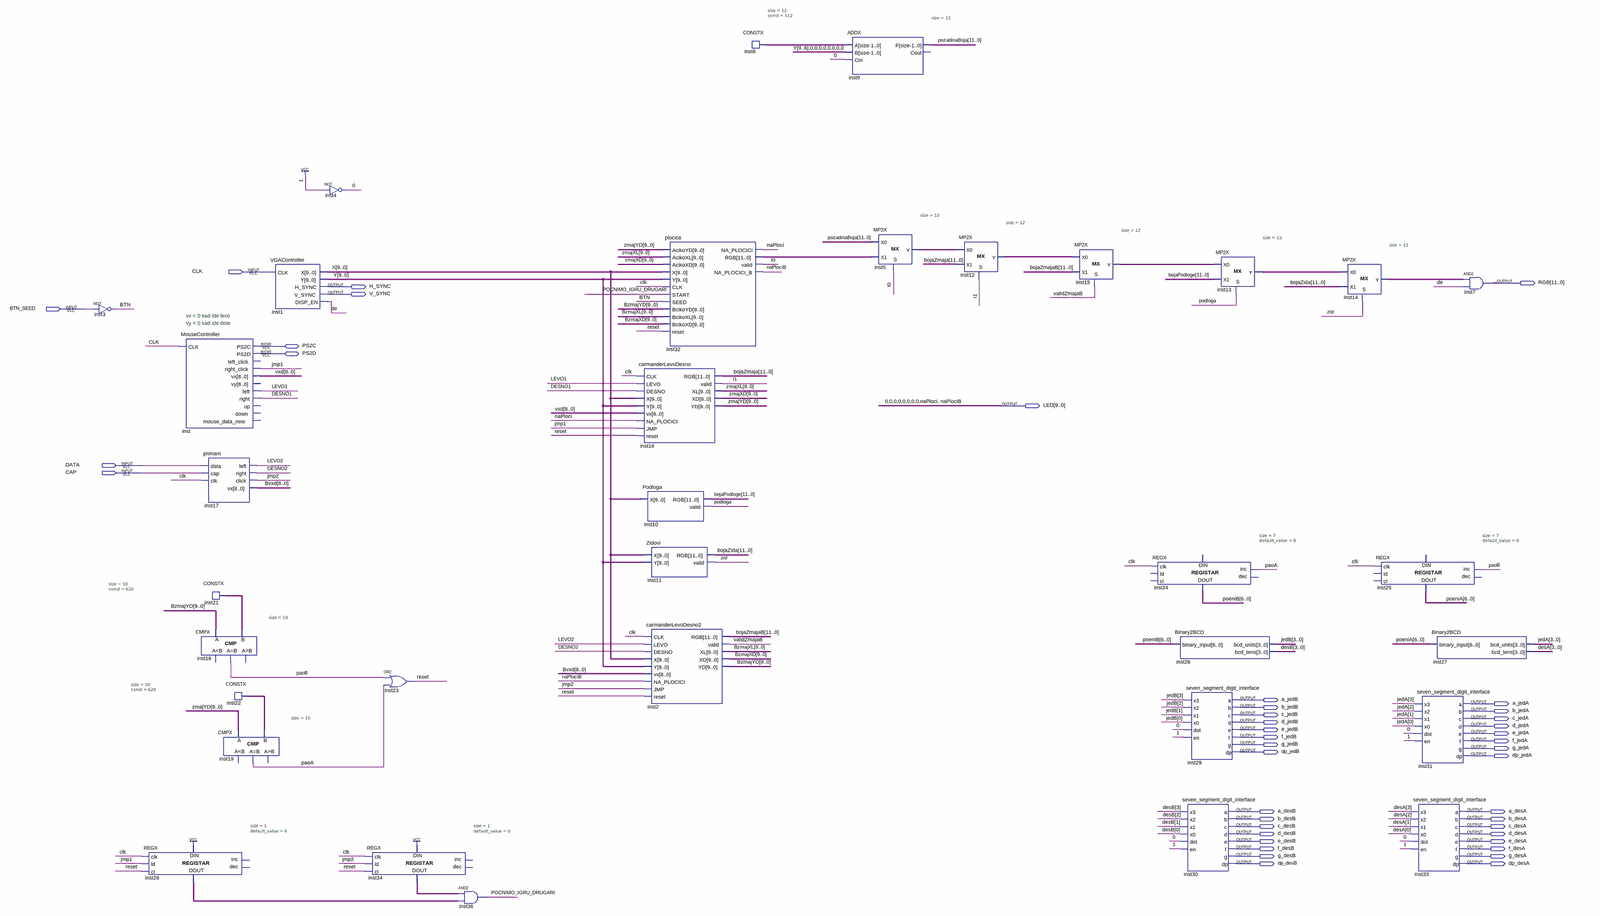
[diagram p0: schematic sheet, whole]
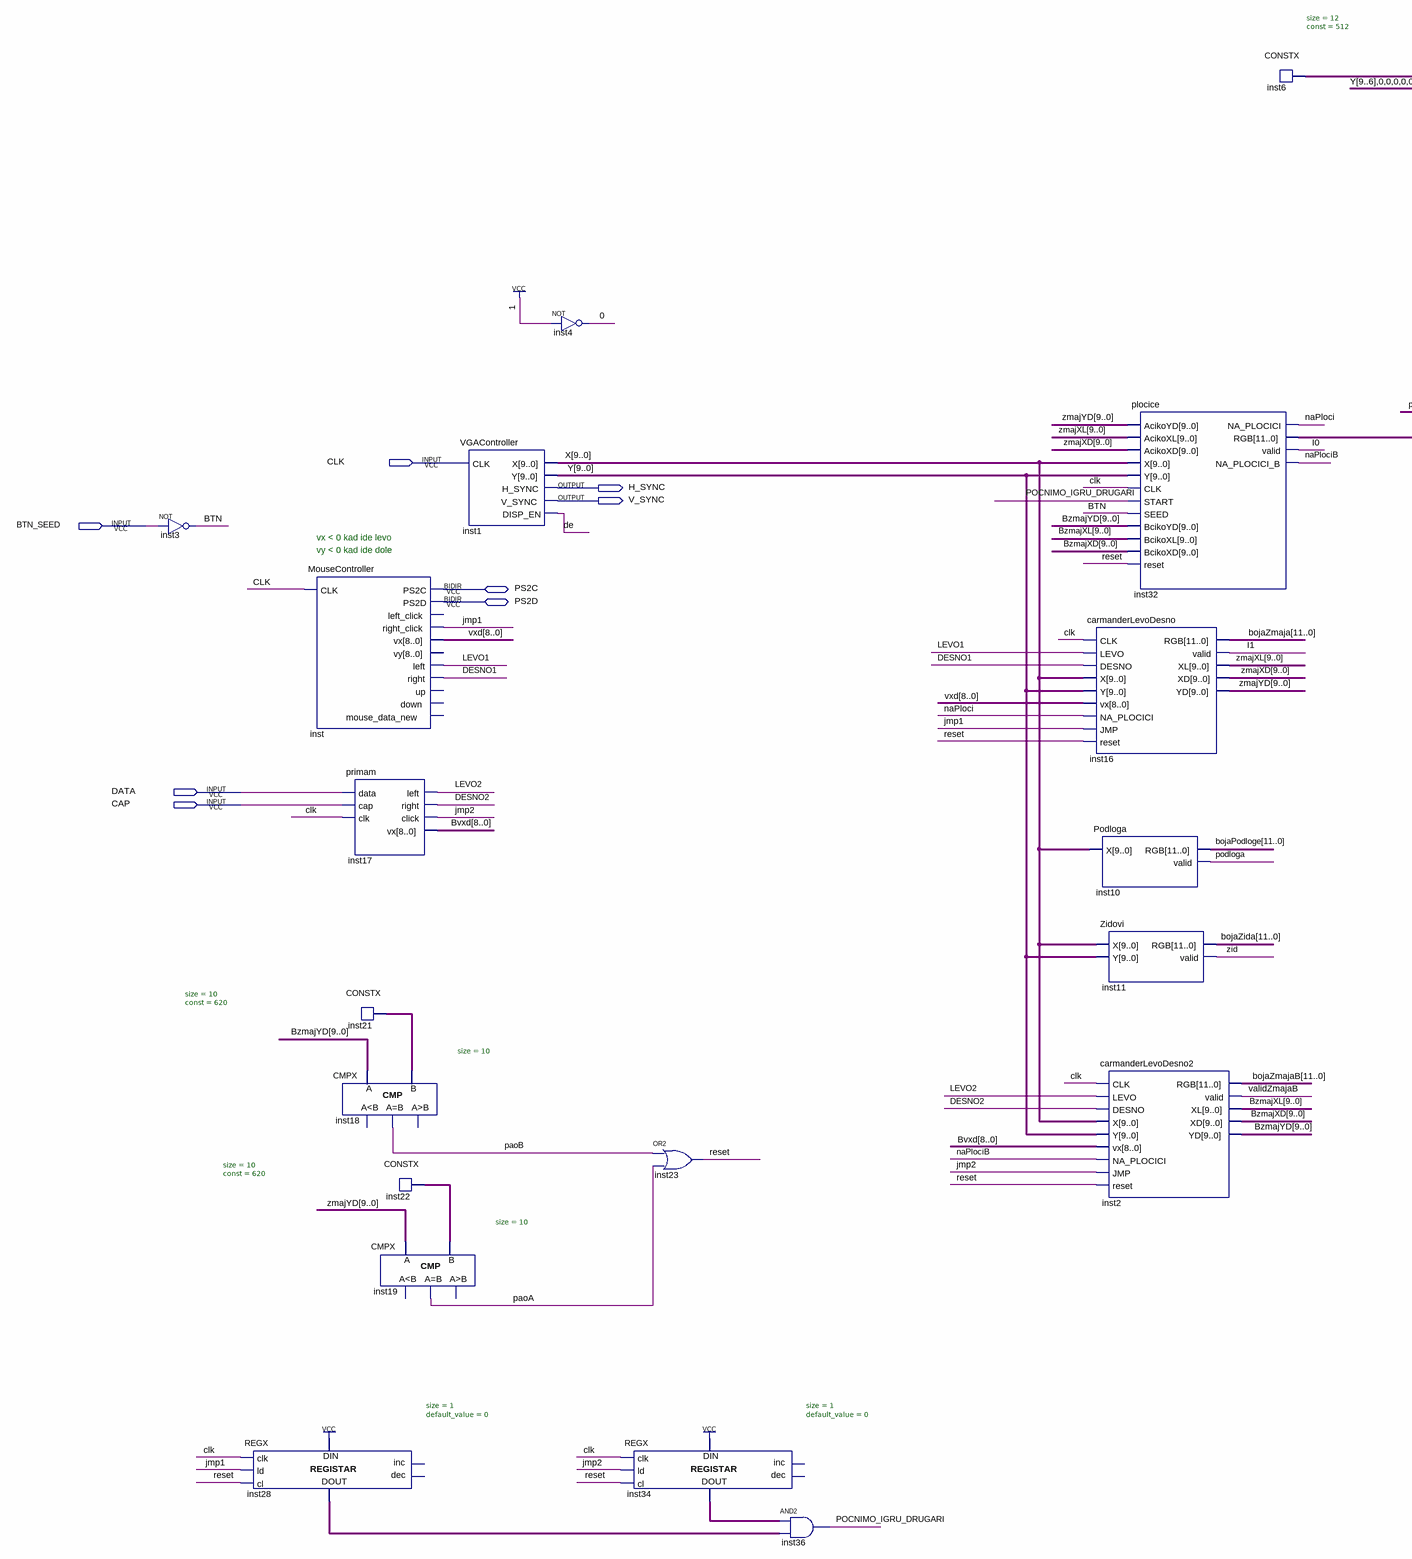
[diagram p1: schematic sheet, left part]
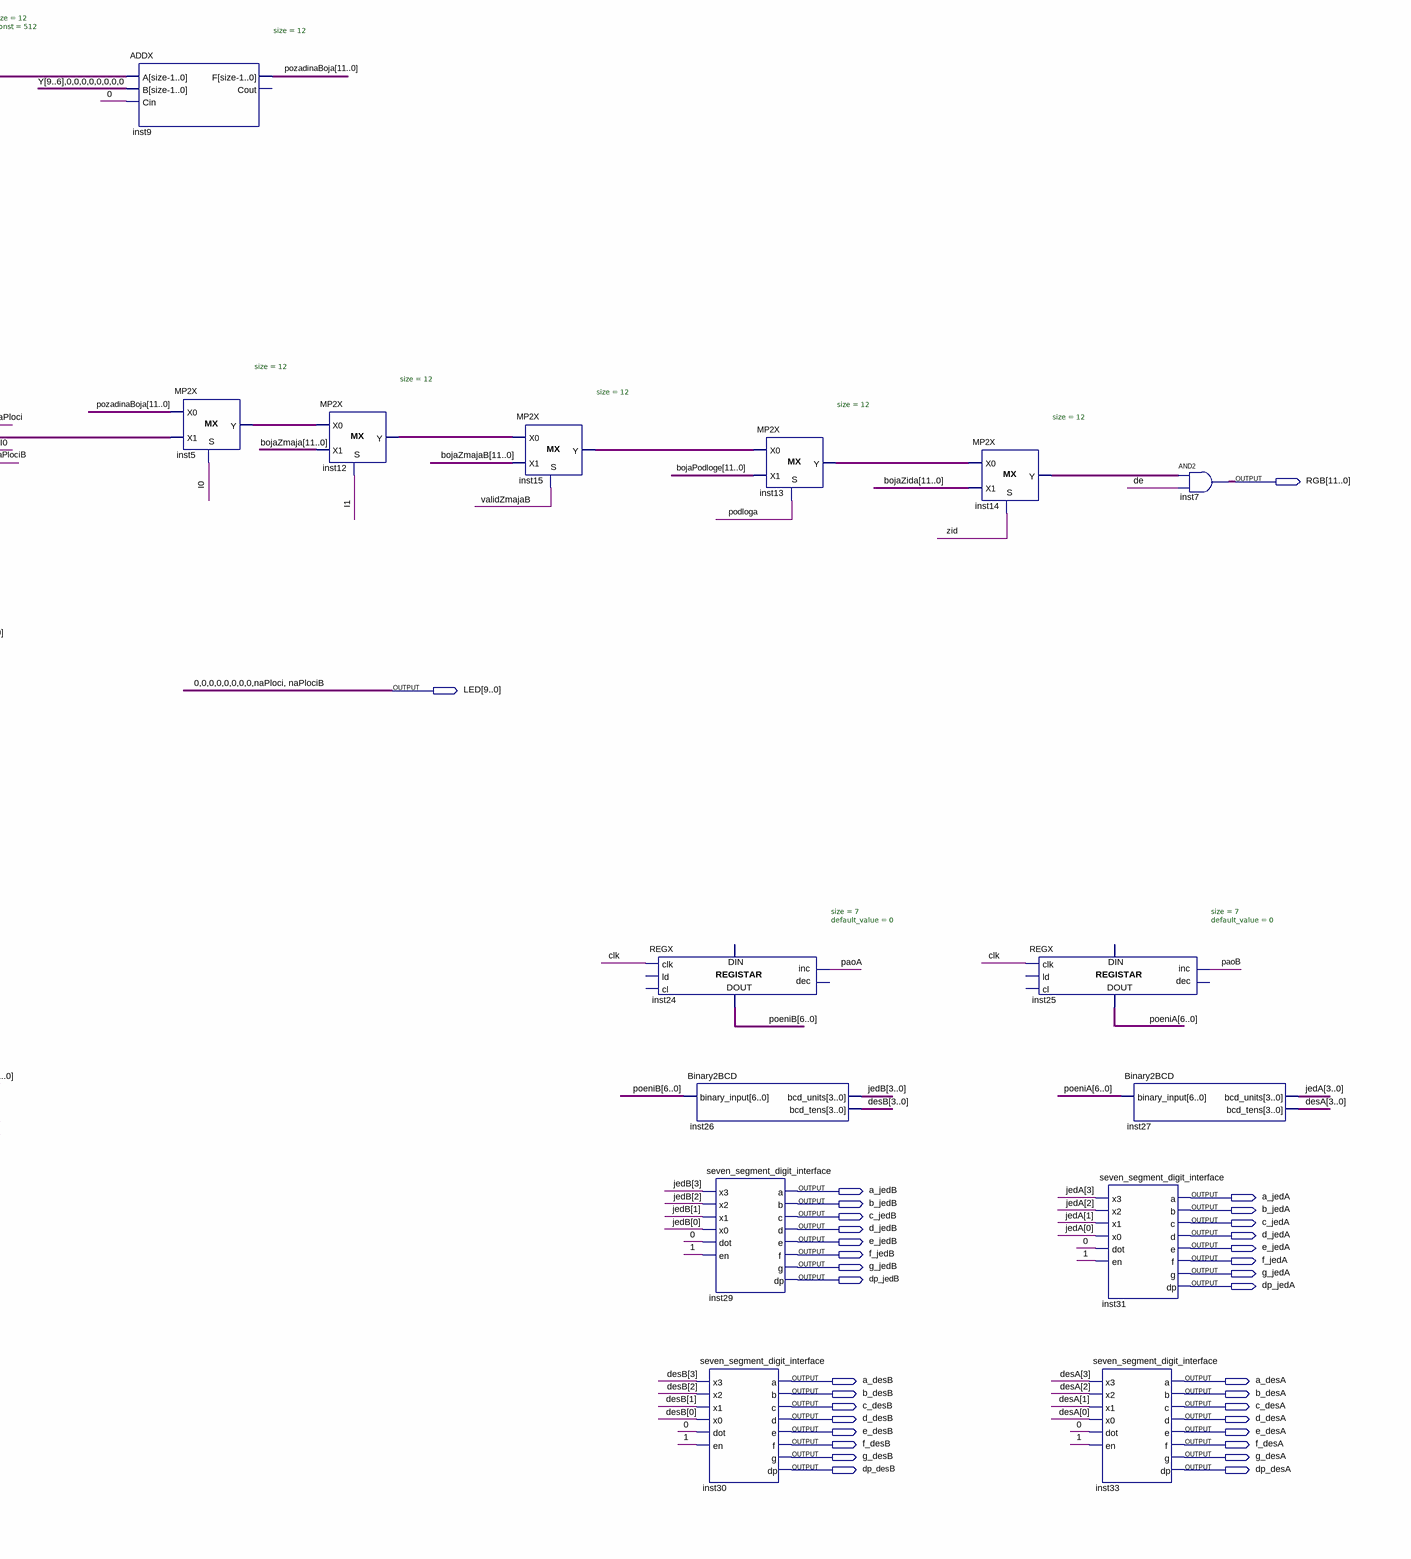
[diagram p2: schematic sheet, right part]
// Quartus schematic main.bdf as structural Verilog: 34 symbols, 42 pins
module main (
  input  CLK,
  input  BTN_SEED,
  input  DATA,
  input  CAP,
  inout  PS2C,
  inout  PS2D,
  output [11:0] RGB,
  output H_SYNC,
  output V_SYNC,
  output [9:0] LED,
  output a_jedB,
  output a_jedA,
  output b_jedB,
  output b_jedA,
  output c_jedB,
  output c_jedA,
  output d_jedB,
  output d_jedA,
  output e_jedB,
  output e_jedA,
  output f_jedB,
  output f_jedA,
  output g_jedB,
  output g_jedA,
  output dp_jedB,
  output dp_jedA,
  output a_desB,
  output a_desA,
  output b_desB,
  output b_desA,
  output c_desB,
  output c_desA,
  output d_desB,
  output d_desA,
  output e_desB,
  output e_desA,
  output f_desB,
  output f_desA,
  output g_desB,
  output g_desA,
  output dp_desB,
  output dp_desA
);

  wire BTN, de, DESNO1, DESNO2, I0, I1, inst28_data_out, inst34_data_out, jmp1, jmp2, LEVO1, LEVO2, paoA,
       paoB, POCNIMO_IGRU_DRUGARI, podloga, reset, validZmajaB, zid;
  wire [3:0] desA, desB, jedA, jedB;
  wire [6:0] poeniA, poeniB;
  wire [8:0] Bvxd, vxd;
  wire [9:0] BzmajXD, BzmajXL, BzmajYD, inst21_data, inst22_data, X, Y, zmajXD, zmajXL, zmajYD;
  wire [11:0] bojaPodloge, bojaZida, bojaZmaja, bojaZmajaB, inst5_y, inst6_data, inst12_y, inst13_y,
       inst14_y, inst15_y, inst32_rgb, pozadinaBoja;

  not inst3 (BTN, BTN_SEED);
  REGX #(.size(1), .default_value(0)) inst28 (
    .clk(CLK), .ld(jmp1), .cl(reset), .data_in(1'b1), .data_out(inst28_data_out));  // open: inc, dec
  MouseController inst (
    .CLK(CLK), .right_click(jmp1), .vx(vxd), .left(LEVO1), .right(DESNO1), .PS2C(PS2C), .PS2D(PS2D));  // open: left_click, vy, up, down, mouse_data_new
  CMPX #(.size(10)) inst18 (.A(BzmajYD), .B(inst21_data), .eq(paoB));  // open: ls, gr
  primam inst17 (.data(DATA), .cap(CAP), .clk(CLK), .left(LEVO2), .right(DESNO2), .click(jmp2), .vx(Bvxd));
  CONSTX #(.size(10), .\const (620)) inst21 (.data(inst21_data));
  CONSTX #(.size(10), .\const (620)) inst22 (.data(inst22_data));
  CMPX #(.size(10)) inst19 (.A(zmajYD), .B(inst22_data), .eq(paoA));  // open: ls, gr
  VGAController inst1 (.CLK(CLK), .X(X), .Y(Y), .H_SYNC(H_SYNC), .V_SYNC(V_SYNC), .DISP_EN(de));
  not inst4 (LED[9], 1'b1);
  REGX #(.size(1), .default_value(0)) inst34 (
    .clk(CLK), .ld(jmp2), .cl(reset), .data_in(1'b1), .data_out(inst34_data_out));  // open: inc, dec
  or inst23 (reset, paoB, paoA);
  and inst36 (POCNIMO_IGRU_DRUGARI, inst34_data_out, inst28_data_out);
  carmanderLevoDesno inst16 (
    .CLK(CLK), .LEVO(LEVO1), .DESNO(DESNO1), .X(X), .Y(Y), .vx(vxd), .NA_PLOCICI(LED[1]), .JMP(jmp1),
    .reset(reset), .RGB(bojaZmaja), .valid(I1), .XL(zmajXL), .XD(zmajXD), .YD(zmajYD));
  Podloga inst10 (.X(X), .RGB(bojaPodloge), .valid(podloga));
  plocice inst32 (
    .AcikoYD(zmajYD), .AcikoXL(zmajXL), .AcikoXD(zmajXD), .X(X), .Y(Y), .CLK(CLK),
    .START(POCNIMO_IGRU_DRUGARI), .SEED(BTN), .BcikoYD(BzmajYD), .BcikoXL(BzmajXL), .BcikoXD(BzmajXD),
    .reset(reset), .NA_PLOCICI(LED[1]), .RGB(inst32_rgb), .valid(I0), .NA_PLOCICI_B(LED[0]));
  Zidovi inst11 (.X(X), .Y(Y), .RGB(bojaZida), .valid(zid));
  carmanderLevoDesno2 inst2 (
    .CLK(CLK), .LEVO(LEVO2), .DESNO(DESNO2), .X(X), .Y(Y), .vx(Bvxd), .NA_PLOCICI(LED[0]), .JMP(jmp2),
    .reset(reset), .RGB(bojaZmajaB), .valid(validZmajaB), .XL(BzmajXL), .XD(BzmajXD), .YD(BzmajYD));
  CONSTX #(.size(12), .\const (512)) inst6 (.data(inst6_data));
  ADDX #(.size(12)) inst9 (.A(inst6_data), .B({Y[9:6], {8{LED[9]}}}), .Cin(LED[9]), .F(pozadinaBoja));  // open: Cout
  MP2X #(.size(12)) inst5 (.S(I0), .X0(pozadinaBoja), .X1(inst32_rgb), .Y(inst5_y));
  MP2X #(.size(12)) inst12 (.S(I1), .X0(inst5_y), .X1(bojaZmaja), .Y(inst12_y));
  MP2X #(.size(12)) inst15 (.S(validZmajaB), .X0(inst12_y), .X1(bojaZmajaB), .Y(inst15_y));
  REGX #(.size(7), .default_value(0)) inst24 (.clk(CLK), .inc(paoA), .data_out(poeniB));  // open: ld, cl, dec, data_in
  Binary2BCD inst26 (.binary_input(poeniB), .bcd_units(jedB), .bcd_tens(desB));
  seven_segment_digit_interface inst29 (
    .x3(jedB[3]), .x2(jedB[2]), .x1(jedB[1]), .x0(jedB[0]), .dot(LED[9]), .en(1'b1), .a(a_jedB), .b(b_jedB),
    .c(c_jedB), .d(d_jedB), .e(e_jedB), .f(f_jedB), .g(g_jedB), .dp(dp_jedB));
  seven_segment_digit_interface inst30 (
    .x3(desB[3]), .x2(desB[2]), .x1(desB[1]), .x0(desB[0]), .dot(LED[9]), .en(1'b1), .a(a_desB), .b(b_desB),
    .c(c_desB), .d(d_desB), .e(e_desB), .f(f_desB), .g(g_desB), .dp(dp_desB));
  MP2X #(.size(12)) inst13 (.S(podloga), .X0(inst15_y), .X1(bojaPodloge), .Y(inst13_y));
  MP2X #(.size(12)) inst14 (.S(zid), .X0(inst13_y), .X1(bojaZida), .Y(inst14_y));
  REGX #(.size(7), .default_value(0)) inst25 (.clk(CLK), .inc(paoB), .data_out(poeniA));  // open: ld, cl, dec, data_in
  seven_segment_digit_interface inst31 (
    .x3(jedA[3]), .x2(jedA[2]), .x1(jedA[1]), .x0(jedA[0]), .dot(LED[9]), .en(1'b1), .a(a_jedA), .b(b_jedA),
    .c(c_jedA), .d(d_jedA), .e(e_jedA), .f(f_jedA), .g(g_jedA), .dp(dp_jedA));
  seven_segment_digit_interface inst33 (
    .x3(desA[3]), .x2(desA[2]), .x1(desA[1]), .x0(desA[0]), .dot(LED[9]), .en(1'b1), .a(a_desA), .b(b_desA),
    .c(c_desA), .d(d_desA), .e(e_desA), .f(f_desA), .g(g_desA), .dp(dp_desA));
  Binary2BCD inst27 (.binary_input(poeniA), .bcd_units(jedA), .bcd_tens(desA));
  assign RGB = inst14_y & {12{de}};  // AND2 inst7, 12 bits wide

  assign LED[8:2] = {7{LED[9]}};

  // Other names for the same wires on the sheet: 0 = LED[9]; naPloci = LED[1]; naPlociB = LED[0]

  // Notes on the sheet:
  //   vx < 0 kad ide levo
  //   vy < 0 kad ide dole
endmodule
